# Altium project PumpSystem.PrjPCB (part 4 of 8)
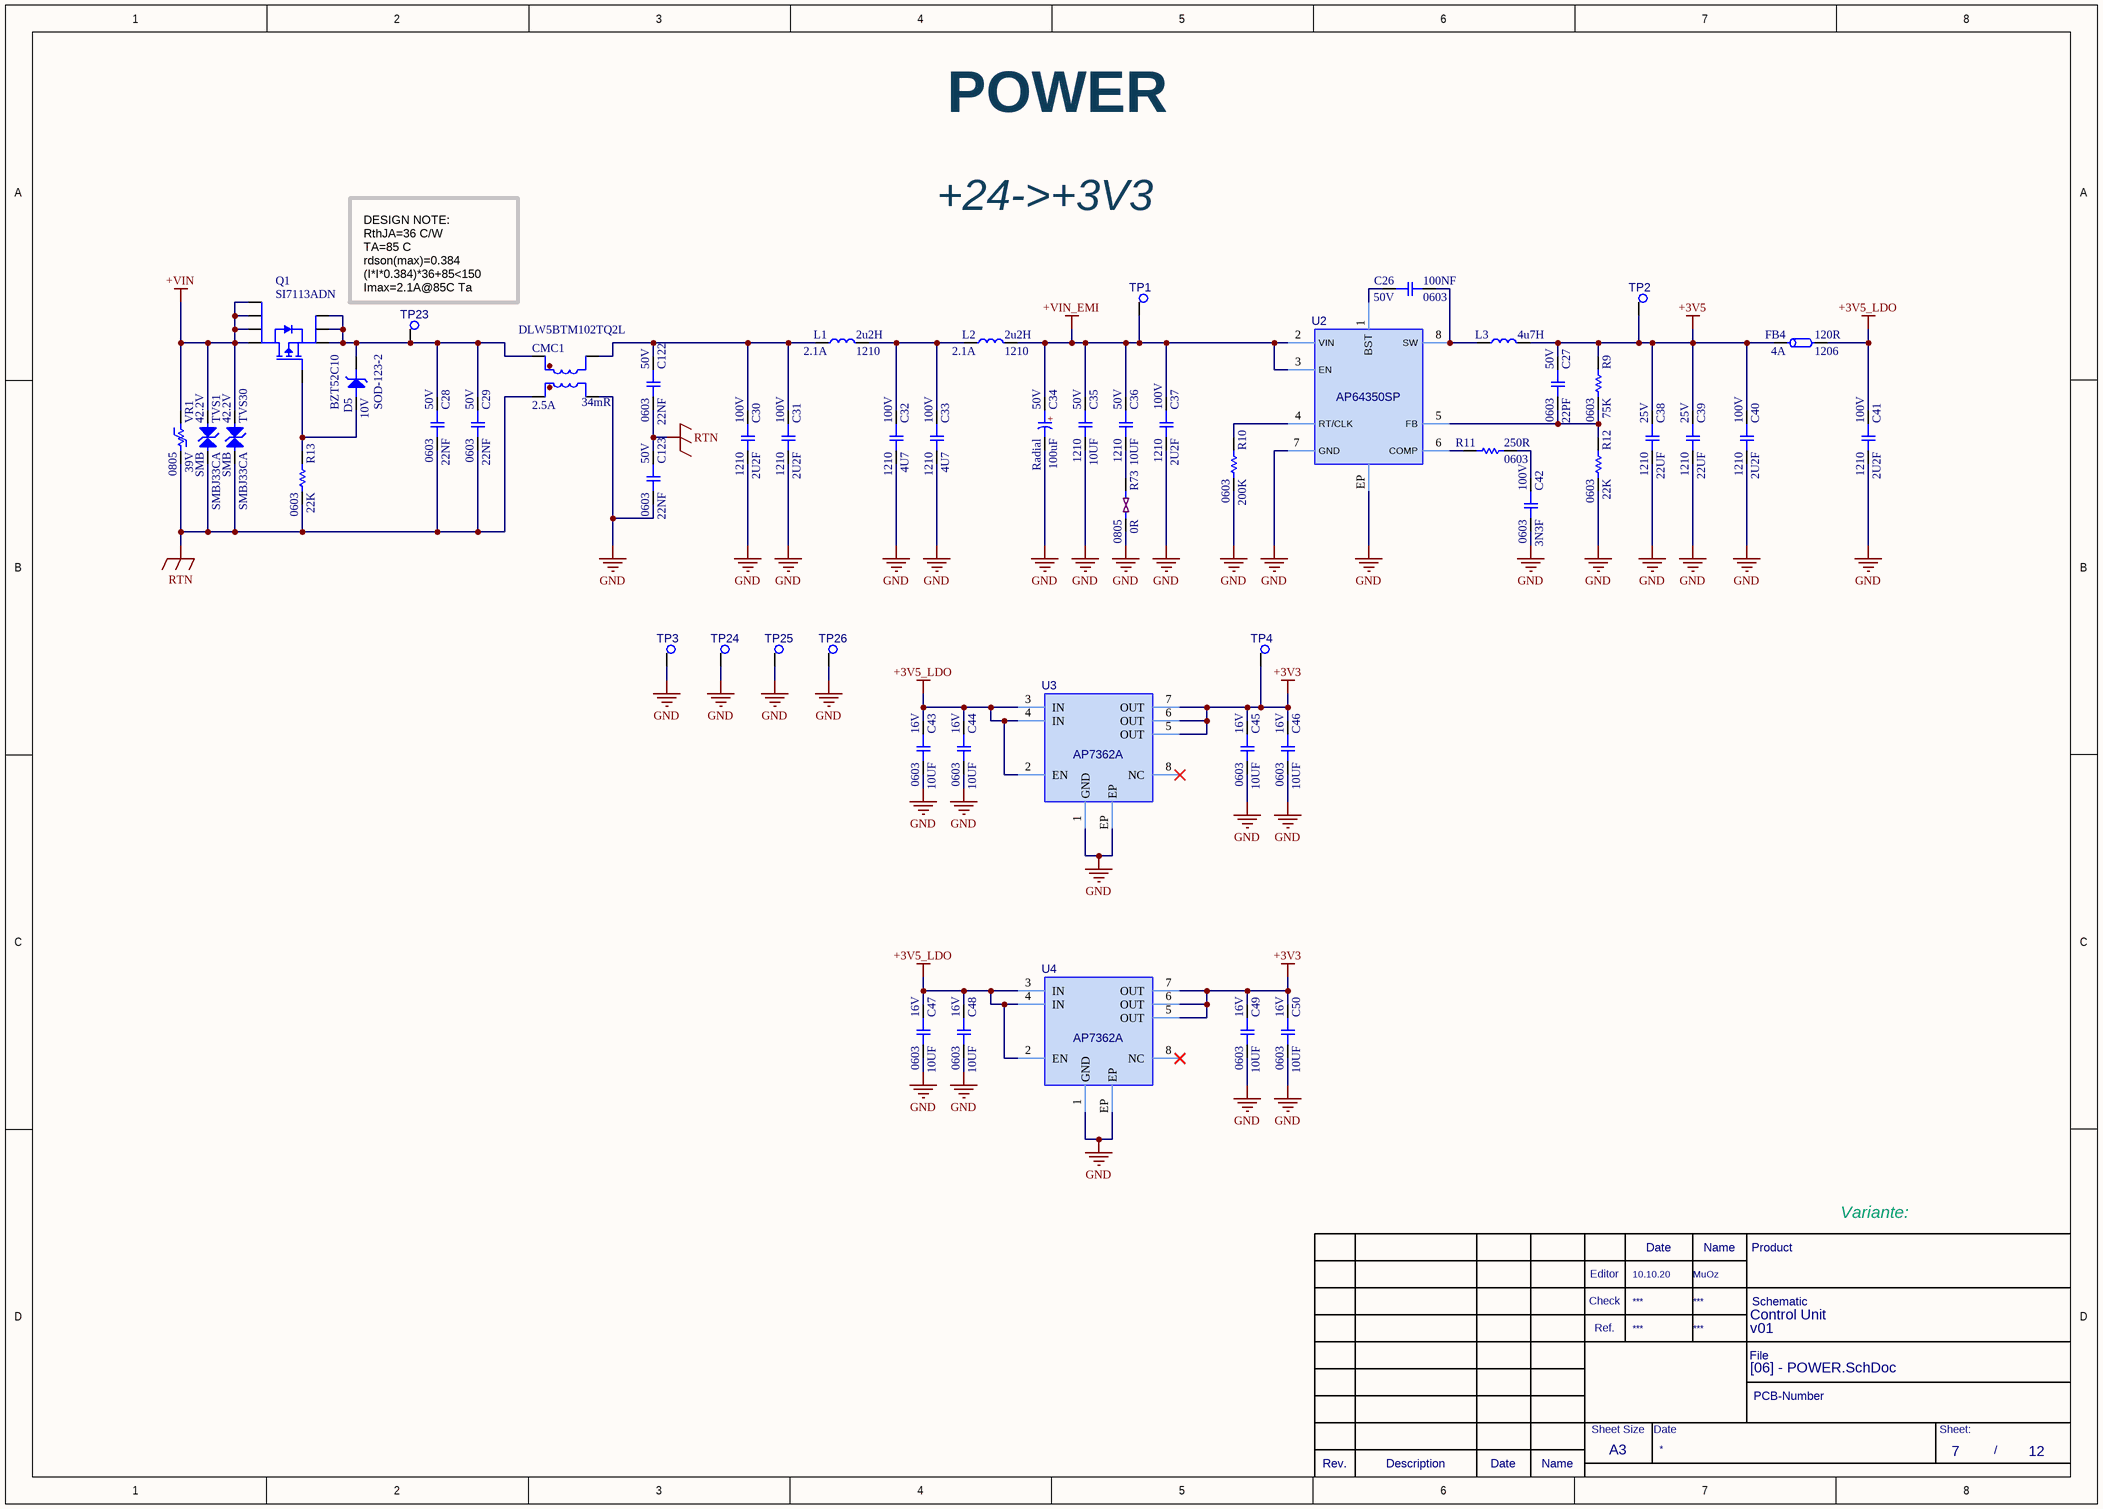
[diagram p12: [06] - POWER.SchDoc]

## Sheet [06] - POWER.SchDoc (continued)

### Library data of the parts
C26 = C-100NF-0603: CAP CER 0.1UF 50V X7R 0603; Manufacturer: TDK; Manufacturer Part Number: C1608X7R1H104K080AA; Dielectric Material: Ceramic; Tolerance: 10%; Temperature Coefficient: 30ppm/°C; .PCBCHK: CHECKED; .Creator: F:TALI; Washability: OK; Supplier 1: Digi-Key; Supplier Part Number 1: 445-1314-1-ND; Stock 1: 0; Pricing 1: 1=0.1, 10=0.057, 100=0.0254, 500=0.01812, 1000=0.01423 (USD); Mount: Surface Mount; Case/Package: 0603; Number of Pins: 2; Weight: 7.1E-05oz; Case Code (Metric): 1608; Min Operating Temperature: -55°C; Max Operating Temperature: 125°C; Capacitance: 100nF; Dielectric: X7R; Packaging: Tape and Reel; Package Quantity: 1; Termination: SMD/SMT; Voltage: 50V; Voltage Rating (DC): 50V; Composition: Ceramic; Length: 1.6mm; Height: 0.8mm; Depth: 0.8mm; Width: 0.8mm; Thickness: 0.037inch; Radiation Hardening: No; REACH SVHC: No SVHC; Lead Free: Lead Free; ComponentLink1URL: http://www.mouser.com/ds/2/400/lcc_commercial_general_en-837201.pdf; ComponentLink1Description: http://www.mouser.com/ds/2/400/lcc_commercial_general_en-837201.pdf; ComponentLink2URL: https://product.tdk.com/info/en/catalog/spec/mlccspec_commercial_general_midvoltage_en.pdf; ComponentLink2Description: https://product.tdk.com/info/en/catalog/spec/mlccspec_commercial_general_midvoltage_en.pdf; ComponentLink3URL: http://uk.rs-online.com/webdocs/13d1/0900766b813d1103.pdf; ComponentLink3Description: http://uk.rs-online.com/webdocs/13d1/0900766b813d1103.pdf; ComponentLink4URL: http://www.tdk.co.jp/tefe02/e412_c.pdf; ComponentLink4Description: http://www.tdk.co.jp/tefe02/e412_c.pdf; ComponentLink5URL: http://www.farnell.com/datasheets/2291921.pdf; ComponentLink5Description: http://www.farnell.com/datasheets/2291921.pdf; ComponentLink6URL: http://www.farnell.com/datasheets/1744655.pdf; ComponentLink6Description: http://www.farnell.com/datasheets/1744655.pdf; Supplier 2: Digi-Key; Supplier Part Number 2: 478-3540-6-ND; Stock 2: 40000; Pricing 2: 1=0.23, 10=0.161, 100=0.0756, 500=0.05304, 1000=0.0439 (USD); Contact Plating: Matte,Tin; Features: Soft Termination; ComponentLink7URL: http://catalogs.avx.com/SurfaceMount.pdf; ComponentLink7Description: http://catalogs.avx.com/SurfaceMount.pdf; ComponentLink8URL: http://www.farnell.com/datasheets/630895.pdf; ComponentLink8Description: http://www.farnell.com/datasheets/630895.pdf; ComponentLink9URL: http://www.avx.com/docs/Catalogs/cx7r.pdf; ComponentLink9Description: http://www.avx.com/docs/Catalogs/cx7r.pdf; ComponentLink10URL: http://www.avx.com/docs/catalogs/cauto.pdf; ComponentLink10Description: http://www.avx.com/docs/catalogs/cauto.pdf; ComponentLink11URL: https://www.verical.com/server-webapp/html/getDatasheet?partID=98691; ComponentLink11Description: https://www.verical.com/server-webapp/html/getDatasheet?partID=98691; ComponentLink12URL: https://www.avx.com/docs/Catalogs/flexiterm.pdf; ComponentLink12Description: https://www.avx.com/docs/Catalogs/flexiterm.pdf; .SCHCHK: CHECKED
C27 = C-22PF-0603: CAP CER 22PF 50V C0G/NP0 0603; Manufacturer: Samsung; Manufacturer Part Number: CL10C220JB8NNNC; Material: Ceramic; Tolerance: 5%; Dielectric: C0G; Temperature Coefficient: 300ppm/°C; Insulation Resistance: 100GR; .PCBCHK: USED; .Creator: F:TALI; Washability: OK; Supplier 1: Digi-Key; Supplier Part Number 1: 1276-1023-6-ND; Stock 1: 0; Pricing 1: 1=0.1, 10=0.056, 100=0.0251, 500=0.0179, 1000=0.01406 (USD); Mount: Surface Mount; Case Code (Metric): 1608; Case Code (Imperial): 0603; Contact Plating: Tin; Min Operating Temperature: -55°C; Max Operating Temperature: 125°C; Capacitance: 22pF; Voltage: 50V; Voltage Rating (DC): 50V; Package Quantity: 1; Packaging: Tape and Reel; Length: 1.6mm; Height: 0.8mm; Depth: 0.8mm; Width: 0.031inch; Thickness: 0.035inch; Radiation Hardening: No; Lead Free: Lead Free; ComponentLink1URL: http://www1.futureelectronics.com/doc/SAMSUNG%20PASSIVE/CL05B104KQ5NNNC.pdf; ComponentLink1Description: http://www1.futureelectronics.com/doc/SAMSUNG%20PASSIVE/CL05B104KQ5NNNC.pdf; ComponentLink2URL: https://media.digikey.com/pdf/Data%20Sheets/Samsung%20PDFs/CL_Series_MLCC_ds.pdf; ComponentLink2Description: https://media.digikey.com/pdf/Data%20Sheets/Samsung%20PDFs/CL_Series_MLCC_ds.pdf; ComponentLink3URL: https://www.distrelec.biz/Web/Downloads/_e/ng/MLCC_CatalogDownload2013_ENG.pdf?mime=application%2Fpdf; ComponentLink3Description: https://www.distrelec.biz/Web/Downloads/_e/ng/MLCC_CatalogDownload2013_ENG.pdf?mime=application%2Fpdf; ComponentLink4URL: https://produktinfo.conrad.com/datenblaetter/450000-474999/457135-da-01-en-VS_KONDENSATOR_0603.pdf; ComponentLink4Description: https://produktinfo.conrad.com/datenblaetter/450000-474999/457135-da-01-en-VS_KONDENSATOR_0603.pdf; Supplier 2: Digi-Key; Supplier Part Number 2: 478-1167-6-ND; Stock 2: 40000; Pricing 2: 1=0.1, 10=0.073, 100=0.0324, 500=0.02314, 1000=0.01818 (USD); Number of Pins: 2; Dielectric Material: Ceramic; Termination: SMD/SMT; REACH SVHC: No SVHC; ComponentLink5URL: http://www.avx.com/docs/Catalogs/ccog.pdf; ComponentLink5Description: http://www.avx.com/docs/Catalogs/ccog.pdf; ComponentLink6URL: https://www.verical.com/server-webapp/html/getDatasheet?partID=60906; ComponentLink6Description: https://www.verical.com/server-webapp/html/getDatasheet?partID=60906; ComponentLink7URL: http://www.farnell.com/datasheets/759117.pdf; ComponentLink7Description: http://www.farnell.com/datasheets/759117.pdf; ComponentLink8URL: http://catalogs.avx.com/SurfaceMount.pdf; ComponentLink8Description: http://catalogs.avx.com/SurfaceMount.pdf; ComponentLink9URL: http://uk.rs-online.com/webdocs/140c/0900766b8140c8fe.pdf; ComponentLink9Description: http://uk.rs-online.com/webdocs/140c/0900766b8140c8fe.pdf; Supplier 3: Digi-Key; Supplier Part Number 3: 1276-2228-6-ND; Stock 3: 3383; Pricing 3: 1=0.1, 10=0.048, 100=0.0214, 500=0.01532, 1000=0.01203 (USD); ComponentLink10URL: http://www1.futureelectronics.com/doc/SAMSUNG/CL10C220JB8NFNC.pdf; ComponentLink10Description: http://www1.futureelectronics.com/doc/SAMSUNG/CL10C220JB8NFNC.pdf; ComponentLink11URL: http://www.samsungsem.com/kr/support/product-search/mlcc/CL10C220JB8NFNC.jsp; ComponentLink11Description: http://www.samsungsem.com/kr/support/product-search/mlcc/CL10C220JB8NFNC.jsp; .SCHCHK: USED
C28 = C-22NF-0603: CAP CER 0.022UF 50V X7R 0603L; Manufacturer: Yageo; Manufacturer Part Number: CC0603KRX7R9BB223; Tolerance: 10%; Dielectric Material: Ceramic; .PCBCHK: USED; .Creator: M.OZKAN; Washability: OK; Insulation Resistance: 100GR; Supplier 1: Digi-Key; Supplier Part Number 1: 311-1370-1-ND; Stock 1: 144094; Pricing 1: 1=0.10000, 10=0.06700, 100=0.03000, 500=0.02140, 1000=0.01682 (USD); Mount: Surface Mount; Min Operating Temperature: -55°C; Max Operating Temperature: 125°C; Capacitance: 22nF; Dielectric: X7R; Packaging: Tape and Reel; Package Quantity: 1; Voltage: 50V; Voltage Rating (DC): 50V; Length: 1.6mm; Height: 0.8mm; Depth: 0.8mm; Width: 0.031inch; Thickness: 0.035inch; Radiation Hardening: No; Lead Free: Lead Free; ComponentLink1URL: https://datasheet.ciiva.com/156/mlccorderingcode-156177.pdf?src-supplier=Digi-Key; ComponentLink1Description: https://datasheet.ciiva.com/156/mlccorderingcode-156177.pdf?src-supplier=Digi-Key; ComponentLink2URL: https://datasheet.ciiva.com/156/mlccorderingcode-156178.pdf?src-supplier=Digi-Key; ComponentLink2Description: https://datasheet.ciiva.com/156/mlccorderingcode-156178.pdf?src-supplier=Digi-Key; Case Code (Metric): 1608; Case Code (Imperial): 0603; ComponentLink3URL: https://datasheet.ciiva.com/156/mlccorderingcode-156179.pdf?src-supplier=Digi-Key; ComponentLink3Description: https://datasheet.ciiva.com/156/mlccorderingcode-156179.pdf?src-supplier=Digi-Key; ComponentLink4URL: https://datasheet.ciiva.com/11464/upy-gphc-x7r-6-3v-to-50v-8-11464741.pdf?src-supplier=Avnet; ComponentLink4Description: https://datasheet.ciiva.com/11464/upy-gphc-x7r-6-3v-to-50v-8-11464741.pdf?src-supplier=Avnet; Number of Pins: 2; Termination: SMD/SMT; REACH SVHC: No SVHC; ComponentLink5URL: https://datasheet.ciiva.com/8033/1489800-8033865.pdf?src-supplier=Element14; ComponentLink5Description: https://datasheet.ciiva.com/8033/1489800-8033865.pdf?src-supplier=Element14; ComponentLink6URL: https://datasheet.ciiva.com/8033/1489800-8033867.pdf?src-supplier=Element14; ComponentLink6Description: https://datasheet.ciiva.com/8033/1489800-8033867.pdf?src-supplier=Element14; ComponentLink7URL: https://datasheet.ciiva.com/16625/upy-gphc-x7r-6-3v-to-50v-8-16625532.pdf?src-supplier=Avnet+Europe; ComponentLink7Description: https://datasheet.ciiva.com/16625/upy-gphc-x7r-6-3v-to-50v-8-16625532.pdf?src-supplier=Avnet+Europe; .SCHCHK: USED; ComponentLink8URL: https://datasheet.ciiva.com/8033/70765-8033869.pdf?src-supplier=Element14; ComponentLink8Description: https://datasheet.ciiva.com/8033/70765-8033869.pdf?src-supplier=Element14; ComponentLink9URL: https://datasheet.ciiva.com/28450/1489800-28450639.pdf?src-supplier=Element14; ComponentLink9Description: https://datasheet.ciiva.com/28450/1489800-28450639.pdf?src-supplier=Element14; RoHS: Yes; Composition: Ceramic; Halogen Free: Halogen Free
C29 C122 C123 = C-22NF-0603: CAP CER 0.022UF 50V X7R 0603L; Manufacturer: Yageo; Manufacturer Part Number: CC0603KRX7R9BB223; Dielectric Material: Ceramic; Insulation Resistance: 100GR; Tolerance: 10%; Washability: OK; .Creator: M.OZKAN; .PCBCHK: USED; Supplier 1: Digi-Key; Supplier Part Number 1: 311-1370-1-ND; Stock 1: 144094; Pricing 1: 1=0.10000, 10=0.06700, 100=0.03000, 500=0.02140, 1000=0.01682 (USD); RoHS: Yes; Mount: Surface Mount; Number of Pins: 2; Case Code (Metric): 1608; Case Code (Imperial): 0603; Min Operating Temperature: -55°C; Max Operating Temperature: 125°C; Termination: SMD/SMT; Composition: Ceramic; Package Quantity: 1; Capacitance: 22nF; Voltage Rating: 50V; Packaging: Tape and Reel; Voltage Rating (DC): 50V; Length: 1.6mm; Height: 0.8mm; Thickness: 0.035inch; Depth: 0.8mm; Width: 0.031inch; Radiation Hardening: No; Lead Free: Lead Free; Halogen Free: Halogen Free; REACH SVHC: No SVHC; ComponentLink1URL: https://datasheet.ciiva.com/156/mlccorderingcode-156177.pdf?src-supplier=Digi-Key; ComponentLink1Description: https://datasheet.ciiva.com/156/mlccorderingcode-156177.pdf?src-supplier=Digi-Key; ComponentLink2URL: https://datasheet.ciiva.com/156/mlccorderingcode-156178.pdf?src-supplier=Digi-Key; ComponentLink2Description: https://datasheet.ciiva.com/156/mlccorderingcode-156178.pdf?src-supplier=Digi-Key; ComponentLink3URL: https://datasheet.ciiva.com/156/mlccorderingcode-156179.pdf?src-supplier=Digi-Key; ComponentLink3Description: https://datasheet.ciiva.com/156/mlccorderingcode-156179.pdf?src-supplier=Digi-Key; ComponentLink4URL: https://datasheet.ciiva.com/11464/upy-gphc-x7r-6-3v-to-50v-8-11464741.pdf?src-supplier=Avnet; ComponentLink4Description: https://datasheet.ciiva.com/11464/upy-gphc-x7r-6-3v-to-50v-8-11464741.pdf?src-supplier=Avnet; ComponentLink5URL: https://datasheet.ciiva.com/8033/1489800-8033865.pdf?src-supplier=Element14; ComponentLink5Description: https://datasheet.ciiva.com/8033/1489800-8033865.pdf?src-supplier=Element14; ComponentLink6URL: https://datasheet.ciiva.com/8033/1489800-8033867.pdf?src-supplier=Element14; ComponentLink6Description: https://datasheet.ciiva.com/8033/1489800-8033867.pdf?src-supplier=Element14; ComponentLink7URL: https://datasheet.ciiva.com/16625/upy-gphc-x7r-6-3v-to-50v-8-16625532.pdf?src-supplier=Avnet+Europe; ComponentLink7Description: https://datasheet.ciiva.com/16625/upy-gphc-x7r-6-3v-to-50v-8-16625532.pdf?src-supplier=Avnet+Europe; ComponentLink8URL: https://datasheet.ciiva.com/8033/70765-8033869.pdf?src-supplier=Element14; ComponentLink8Description: https://datasheet.ciiva.com/8033/70765-8033869.pdf?src-supplier=Element14; ComponentLink9URL: https://datasheet.ciiva.com/28450/1489800-28450639.pdf?src-supplier=Element14; ComponentLink9Description: https://datasheet.ciiva.com/28450/1489800-28450639.pdf?src-supplier=Element14; Dielectric: X7R; .SCHCHK: USED
C30 C31 C37 C40 C41 = C-2U2F-1210: CAP CER 2.2UF 100V X7R 1210; Manufacturer: Samsung; Manufacturer Part Number: CL32B225KCJSNNE; Tolerance: 10%; .PCBCHK: CHECKED; .Creator: F:TALI; Washability: OK; Supplier 1: Digi-Key; Supplier Part Number 1: 1276-3362-6-ND; Stock 1: 0; Pricing 1: 1=0.58, 10=0.41, 100=0.27, 500=0.2 (USD); Mount: Surface Mount; Case Code (Metric): 3225; Case Code (Imperial): 1210; Contact Plating: Tin; Min Operating Temperature: -55°C; Max Operating Temperature: 125°C; Capacitance: 2.2uF; Voltage Rating: 100V; Packaging: Tape and Reel; Package Quantity: 1; Dielectric: X7R; Length: 3.2mm; Height: 2.5mm; Width: 0.098inch; Thickness: 0.106inch; Depth: 2.5mm; Radiation Hardening: No; ComponentLink1URL: http://www1.futureelectronics.com/doc/SAMSUNG/CL32B225KCJSNNE.pdf; ComponentLink1Description: http://www1.futureelectronics.com/doc/SAMSUNG/CL32B225KCJSNNE.pdf; ComponentLink2URL: http://www.samsungsem.com/kr/support/product-search/mlcc/CL32B225KCJSNNE .jsp; ComponentLink2Description: http://www.samsungsem.com/kr/support/product-search/mlcc/CL32B225KCJSNNE .jsp; ComponentLink3URL: https://www.verical.com/server-webapp/html/getDatasheet?partID=357497; ComponentLink3Description: https://www.verical.com/server-webapp/html/getDatasheet?partID=357497; Supplier 2: Digi-Key; Supplier Part Number 2: 445-4497-6-ND; Stock 2: 0; Pricing 2: 1=0.92, 10=0.648, 100=0.4269, 500=0.31626 (USD); Number of Pins: 2; Weight: 0.000564oz; Voltage Rating (DC): 100V; Termination: SMD/SMT; Composition: Ceramic; REACH SVHC: No SVHC; Lead Free: Lead Free; ComponentLink4URL: http://www.mouser.com/ds/2/400/lcc_commercial_general_en-837201.pdf; ComponentLink4Description: http://www.mouser.com/ds/2/400/lcc_commercial_general_en-837201.pdf; ComponentLink5URL: http://www.farnell.com/datasheets/1698875.pdf; ComponentLink5Description: http://www.farnell.com/datasheets/1698875.pdf; ComponentLink6URL: http://www.farnell.com/datasheets/1484596.pdf; ComponentLink6Description: http://www.farnell.com/datasheets/1484596.pdf; ComponentLink7URL: https://www.verical.com/server-webapp/html/getDatasheet?partID=725361; ComponentLink7Description: https://www.verical.com/server-webapp/html/getDatasheet?partID=725361; ComponentLink8URL: http://product.tdk.com/en/catalog/datasheets/mlcc_commercial_midvoltage_en.pdf; ComponentLink8Description: http://product.tdk.com/en/catalog/datasheets/mlcc_commercial_midvoltage_en.pdf; Supplier 3: Digi-Key; Supplier Part Number 3: 587-4235-6-ND; Stock 3: 0; Pricing 3: 1=1.42, 10=1.121, 100=0.8409 (USD); Features: Soft Termination; Ratings: AEC-Q200; .SCHCHK: CHECKED
C32 C33 = C-4U7-1210-100V: CAP CER 4.7UF 100V X7S 1210; Manufacturer: Taiyo Yuden; Manufacturer Part Number: HMK325C7475KM-PE; Tolerance: 10%; Washability: OK; Supplier 1: Digi-Key; Supplier Part Number 1: 587-HMK325C7475KM-PECT-ND; Stock 1: 0; Pricing 1: 1=1.10000, 10=0.83900, 100=0.60030, 500=0.46474 (USD); RoHS: No; Mount: Surface Mount; Min Operating Temperature: -55°C; Max Operating Temperature: 125°C; Packaging: Tape and Reel; Capacitance: 4.7uF; ComponentLink1URL: http://ds.yuden.co.jp/TYCOMPAS/ut/detail.do?productNo=HMK325C7475KM-PE&amp;fileName=HMK325C7475KM-PE_SS&amp;mode=specSheetDownload&src-supplier=Digi-Key; ComponentLink1Description: http://ds.yuden.co.jp/TYCOMPAS/ut/detail.do?productNo=HMK325C7475KM-PE&amp;fileName=HMK325C7475KM-PE_SS&amp;mode=specSheetDownload&src-supplier=Digi-Key
C34 = C-100UF-SMD: CAP ALUM 100UF 20% 50V SMD; Manufacturer: Nichicon; Manufacturer Part Number: UUD1H101MNL1GS; Dielectric Material: Aluminium; Ripple Current: 300mA; Life (Hours): 5000Hour; Impedance: 340mR; Leakage Current: 3uA; Dissipation Factor: 0.14%; Lead Diameter: 1.1mm; .PCBCHK: CHECKED; .Creator: M.OZKAN; Washability: OK; Supplier 1: Digi-Key; Stock 1: 72155; Pricing 1: 1=0.75, 10=0.554, 100=0.3796 (USD); Number of Pins: 2; Min Operating Temperature: -55°C; Max Operating Temperature: 105°C; Tolerance: 20%; Ripple Current (AC): 300mA; Package Quantity: 500; Packaging: Tape and Reel; Voltage Rating: 50V; Termination: SMD/SMT; Voltage: 50V; Diameter: 8mm; Length: 10mm; Height: 10mm; Lead Pitch: 3.1mm; Height - Seated (Max): 0.394inch; Radiation Hardening: No; REACH SVHC: No SVHC; Lead Free: Lead Free; ComponentLink1URL: http://www.farnell.com/datasheets/2100017.pdf; ComponentLink1Description: http://www.farnell.com/datasheets/2100017.pdf; ComponentLink2URL: http://nichicon-us.com/english/products/pdfs/e-uud.pdf; ComponentLink2Description: http://nichicon-us.com/english/products/pdfs/e-uud.pdf; ComponentLink3URL: http://www.nichicon.co.jp/english/products/pdfs/e-ch_ref.pdf; ComponentLink3Description: http://www.nichicon.co.jp/english/products/pdfs/e-ch_ref.pdf; ComponentLink4URL: http://nichicon-us.com/english/products/pdfs/e-ud.pdf; ComponentLink4Description: http://nichicon-us.com/english/products/pdfs/e-ud.pdf; ComponentLink5URL: http://www.farnell.com/datasheets/1910936.pdf; ComponentLink5Description: http://www.farnell.com/datasheets/1910936.pdf; ComponentLink6URL: http://www.farnell.com/datasheets/66055.pdf; ComponentLink6Description: http://www.farnell.com/datasheets/66055.pdf; ComponentLink7URL: http://uk.rs-online.com/webdocs/0fa3/0900766b80fa39e7.pdf; ComponentLink7Description: http://uk.rs-online.com/webdocs/0fa3/0900766b80fa39e7.pdf; ComponentLink8URL: http://www.nichicon.co.jp/english/products/pdfs/e-ud.pdf; ComponentLink8Description: http://www.nichicon.co.jp/english/products/pdfs/e-ud.pdf; Supplier Part Number 1: 493-2306-6-ND; Supplier 2: Digi-Key; Supplier Part Number 2: 565-2495-6-ND; .SCHCHK: CHECKED; Capacitance: 100uF
C35 C36 = C-10UF-1210: CAP CER 10UF 50V X7R 1210; Manufacturer: Samsung; Manufacturer Part Number: CL32B106KBJNNNE; Material: Ceramic; Tolerance: 10%; .PCBCHK: CHECKED; .Creator: M.OZKAN; Washability: OK; Supplier 1: Digi-Key; Supplier Part Number 1: 1276-3387-6-ND; Stock 1: 0; Pricing 1: 1=0.96, 10=0.704, 100=0.483, 500=0.38238 (USD); Mount: Surface Mount; Case Code (Metric): 3225; Case Code (Imperial): 1210; Min Operating Temperature: -55°C; Max Operating Temperature: 125°C; Packaging: Tape and Reel; Package Quantity: 1; Capacitance: 10uF; Dielectric: X7R; Voltage: 50V; Voltage Rating (DC): 50V; Length: 3.2mm; Height: 2.5mm; Width: 0.098inch; Thickness: 0.106inch; Depth: 2.5mm; Radiation Hardening: No; Lead Free: Lead Free; ComponentLink1URL: http://www.samsungsem.com/kr/support/product-search/mlcc/CL32B106KBJNNNE .jsp; ComponentLink1Description: http://www.samsungsem.com/kr/support/product-search/mlcc/CL32B106KBJNNNE .jsp; ComponentLink2URL: https://produktinfo.conrad.com/datenblaetter/450000-474999/450821-da-01-en-VS_KONDENSATOR_1210.pdf; ComponentLink2Description: https://produktinfo.conrad.com/datenblaetter/450000-474999/450821-da-01-en-VS_KONDENSATOR_1210.pdf; Supplier 2: Digi-Key; Supplier Part Number 2: 587-3167-6-ND; Stock 2: 0; Pricing 2: 1=1.02, 10=0.755, 100=0.5175 (USD); Termination: SMD/SMT; Halogen Free: Halogen Free; ComponentLink3URL: https://www.yuden.co.jp/productdata/catalog/mlcc_all_e.pdf; ComponentLink3Description: https://www.yuden.co.jp/productdata/catalog/mlcc_all_e.pdf; Supplier 3: Digi-Key; Supplier Part Number 3: 1276-3388-6-ND; Stock 3: 0; Pricing 3: 1=0.86, 10=0.61, 100=0.4017, 500=0.29756 (USD); ComponentLink4URL: http://www.samsungsem.com/kr/support/product-search/mlcc/CL32B106KBJNNWE.jsp; ComponentLink4Description: http://www.samsungsem.com/kr/support/product-search/mlcc/CL32B106KBJNNWE.jsp; .SCHCHK: CHECKED
C38 C39 = C-22UF-1210: CAP CER 22UF 25V X7R 1210; Manufacturer: Samsung; Manufacturer Part Number: CL32B226KAJNNNE; Material: Ceramic; Tolerance: 10%; .PCBCHK: CHECKED; .Creator: F:TALI; Washability: OK; Supplier 1: Digi-Key; Supplier Part Number 1: 1276-3392-1-ND; Stock 1: 0; Pricing 1: 1=1.02, 10=0.777, 100=0.556, 500=0.43042 (USD); Mount: Surface Mount; Case/Package: 1210; Case Code (Metric): 3225; Min Operating Temperature: -55°C; Max Operating Temperature: 125°C; Package Quantity: 1; Packaging: Tape and Reel; Capacitance: 22uF; Dielectric: X7R; Voltage Rating (DC): 25V; Length: 3.2mm; Height: 2.5mm; Width: 0.098inch; Thickness: 0.106inch; Depth: 2.5mm; Radiation Hardening: No; Lead Free: Lead Free; ComponentLink1URL: https://media.digikey.com/pdf/Data%20Sheets/Samsung%20PDFs/CL_Series_MLCC_ds.pdf; ComponentLink1Description: https://media.digikey.com/pdf/Data%20Sheets/Samsung%20PDFs/CL_Series_MLCC_ds.pdf; Supplier 2: Digi-Key; Supplier Part Number 2: 1276-3391-6-ND; Stock 2: 0; Pricing 2: 1=0.91, 10=0.671, 100=0.4598, 500=0.36402 (USD); ComponentLink2URL: http://www.samsungsem.com/kr/support/product-search/mlcc/CL32B226KAJNFNE.jsp; ComponentLink2Description: http://www.samsungsem.com/kr/support/product-search/mlcc/CL32B226KAJNFNE.jsp; Supplier 3: Digi-Key; Supplier Part Number 3: 399-11958-6-ND; Stock 3: 0; Pricing 3: 1=1.63, 10=1.289, 100=0.9664, 500=0.7302 (USD); Dielectric Material: Ceramic; Voltage: 25V; Dissipation Factor: 10%; Termination: SMD/SMT; .SCHCHK: CHECKED
C42 = C-3N3F-0603: CAP CER 3300PF 100V X7R 0603; Manufacturer Part Number: CGA3E2X7R2A332K080AA; Manufacturer: TDK; Capacitance: 3.3nF; Tolerance: 10%; .PCBCHK: USED; .Creator: F:TALI; Washability: OK; Supplier 1: Digi-Key; Supplier Part Number 1: 445-5809-6-ND; Mount: Surface Mount; Case Code (Imperial): 0603; Case Code (Metric): 1608; Min Operating Temperature: -55°C; Max Operating Temperature: 125°C; Packaging: Tape and Reel; Length: 1.6mm; Width: 0.031inch; Thickness: 0.035inch; ComponentLink1URL: http://www.mouser.com/ds/2/400/lcc_automotive_midvoltage_en-355485.pdf; ComponentLink1Description: http://www.mouser.com/ds/2/400/lcc_automotive_midvoltage_en-355485.pdf; Stock 1: 22990; Pricing 1: 1=0.1, 10=0.076, 100=0.0338, 500=0.02416, 1000=0.01898 (USD); Weight: 7.1E-05oz; Package Quantity: 4000; Voltage Rating (DC): 100V; Dielectric: X7R; Termination: SMD/SMT; Composition: Ceramic; Height: 0.8mm; Depth: 0.8mm; Ratings: AEC-Q200; REACH SVHC: No SVHC; ComponentLink2URL: http://www.farnell.com/datasheets/1807242.pdf; ComponentLink2Description: http://www.farnell.com/datasheets/1807242.pdf; Supplier 2: Digi-Key; Supplier Part Number 2: 490-14767-6-ND; Stock 2: 40000; Pricing 2: 1=0.16, 10=0.114, 100=0.0535, 500=0.03748, 1000=0.03103 (USD); Radiation Hardening: No; Lead Free: Lead Free; ComponentLink3URL: http://search.murata.co.jp/Ceramy/image/img/w_hinm/S0717E.pdf; ComponentLink3Description: http://search.murata.co.jp/Ceramy/image/img/w_hinm/S0717E.pdf; ComponentLink4URL: http://psearch.murata.com/capacitor/product/GCM188R72A332KA37%23.pdf; ComponentLink4Description: http://psearch.murata.com/capacitor/product/GCM188R72A332KA37%23.pdf; .SCHCHK: USED
C43-C50 = C-10UF-0603: CAP CER 10UF 16V X6S 0603; Manufacturer: Murata; Manufacturer Part Number: GRM188C81C106MA73D; Material: Ceramic; Tolerance: 20%; .PCBCHK: USED; .Creator: M.OZKAN; Washability: OK; Supplier 1: Digi-Key; Supplier Part Number 1: 490-7198-6-ND; Stock 1: 0; Pricing 1: 1=0.53, 10=0.366, 100=0.2195, 500=0.16464, 1000=0.13903 (USD); Mount: Surface Mount; Weight: 0.000222oz; Case Code (Metric): 1608; Case Code (Imperial): 0603; Min Operating Temperature: -55°C; Max Operating Temperature: 105°C; Package Quantity: 4000; Packaging: Tape and Reel; Capacitance: 10uF; Dielectric: X6S; Voltage: 16V; Termination: SMD/SMT; Composition: Ceramic; Voltage Rating (DC): 16V; Length: 1.6mm; Height: 0.8mm; Width: 0.8mm; Thickness: 0.031inch; Depth: 0.8mm; REACH SVHC: No SVHC; Lead Free: Lead Free; ComponentLink1URL: https://www.murata.com/~/media/webrenewal/support/library/catalog/products/capacitor/mlcc/c02e.ashx?la=en-us; ComponentLink1Description: https://www.murata.com/~/media/webrenewal/support/library/catalog/products/capacitor/mlcc/c02e.ashx?la=en-us; Supplier 2: Digi-Key; Supplier Part Number 2: 1276-6769-6-ND; Stock 2: 1927; Pricing 2: 1=0.3, 10=0.205, 100=0.1159, 500=0.08184, 1000=0.07161 (USD); .SCHCHK: USED
CMC1 = CMC-DLW5BTM102TQ2L: CMC 2.5A 2LN 1 KOHM SMD; Manufacturer: Murata; Number of Lines: 2; Voltage Rating (DC): 50V; Impedance: 1kR; Supplier 1: Digi-Key; Supplier Part Number 1: 490-14403-1-ND; Manufacturer Part Number: DLW5BTM102TQ2L; Pricing: 1=1.19, 10=1.102, 25=1.0168, 50=0.8474, 100=0.7966, 250=0.7119 (USD); RoHS: No; Mount: Surface Mount; Min Operating Temperature: -40°C; Max Operating Temperature: 105°C; Packaging: Tape and Reel; Length: 5mm; Width: 5mm; Lead Free: Lead Free; ComponentLink1URL: https://www.murata.com/en-us/products/productdata/8796761587742/EFLC0025.pdf?src-supplier=Digi-Key; ComponentLink1Description: https://www.murata.com/en-us/products/productdata/8796761587742/EFLC0025.pdf?src-supplier=Digi-Key; Stock: 6882
D5 = D-BZT52C10-SOD123: DIODE ZENER 10V 500MW SOD123; Manufacturer: Diodes; Manufacturer Part Number: BZT52C10-7-F; Tolerance: 6%; Forward Voltage: 900mV; Impedance: 20R; Zener Current: 5mA; Peak Reverse Current: 200nA; Element Configuration: Single; Output Current: 50mA; ESD Protection: No; .PCBCHK: CHECKED; .Creator: F:TALI; Forward Current: 250mA; Reverse Recovery Time: 4ns; Max Repetitive Reverse Voltage (Vrrm): 100V; Peak Non-Repetitive Surge Current: 4A; Washability: OK; Supplier 1: Digi-Key; Supplier Part Number 1: BZT52C10-FDIDKR-ND; Stock 1: 339; Pricing 1: 1=0.24, 10=0.218, 100=0.1186, 500=0.07296, 1000=0.04975 (USD); Mount: Surface Mount; Number of Pins: 2; Weight: 0.000353oz; Contact Plating: Matte,Tin; Min Operating Temperature: -65°C; Max Operating Temperature: 150°C; Package Quantity: 3000; Packaging: Tape and Reel; Max Power Dissipation: 500mW; Voltage Tolerance: 6%; Test Current: 5mA; Power Dissipation: 500mW; Max Reverse Leakage Current: 200nA; Working Voltage: 10V; Termination: SMD/SMT; Power Rating: 500mW; Voltage Rating (DC): 10V; Length: 2.85mm; Height: 1.35mm; Width: 1.7mm; Radiation Hardening: No; Lead Free: Lead Free; ComponentLink1URL: https://www.diodes.com/assets/Datasheets/ds18004.pdf; ComponentLink1Description: https://www.diodes.com/assets/Datasheets/ds18004.pdf; ComponentLink2URL: http://www.jameco.com/Jameco/Products/ProdDS/1539497.pdf; ComponentLink2Description: http://www.jameco.com/Jameco/Products/ProdDS/1539497.pdf; Supplier 2: Digi-Key; Supplier Part Number 2: MMSZ5240B-FDIDKR-ND; Stock 2: 34933; Pricing 2: 1=0.25, 10=0.204, 100=0.108, 500=0.07108, 1000=0.04833 (USD); ComponentLink3URL: https://www.verical.com/server-webapp/html/getDatasheet?partID=110273; ComponentLink3Description: https://www.verical.com/server-webapp/html/getDatasheet?partID=110273; ComponentLink4URL: http://www.diodes.com/_files/datasheets/ds18010.pdf; ComponentLink4Description: http://www.diodes.com/_files/datasheets/ds18010.pdf; ComponentLink5URL: http://www.jameco.com/Jameco/Products/ProdDS/1541167.pdf; ComponentLink5Description: http://www.jameco.com/Jameco/Products/ProdDS/1541167.pdf; Supplier 3: Digi-Key; Supplier Part Number 3: MMSZ5240B-HE3-08GICT-ND; Stock 3: 14290; Pricing 3: 1=0.3, 10=0.244, 25=0.2044, 100=0.1295, 250=0.09992, 500=0.08516, 1000=0.05791 (USD); ComponentLink6URL: http://www.mouser.com/ds/2/427/mmsz5225-102133.pdf; ComponentLink6Description: http://www.mouser.com/ds/2/427/mmsz5225-102133.pdf; .SCHCHK: CHECKED; Max Surge Current: 4A; Recovery Time: 4ns; Average Rectified Current: 250mA; Max Forward Surge Current (Ifsm): 4A; Max Reverse Voltage (DC): 100V; REACH SVHC: No SVHC; ComponentLink7URL: http://www.nxp.com/documents/data_sheet/BAV70_SER.pdf; ComponentLink7Description: http://www.nxp.com/documents/data_sheet/BAV70_SER.pdf; ComponentLink8URL: http://www.farnell.com/datasheets/1914003.pdf; ComponentLink8Description: http://www.farnell.com/datasheets/1914003.pdf
FB4 = FB-120R-1206: FERRITE BEAD 120 OHM 1206 1LN; Manufacturer: Laird; Manufacturer Part Number: HI1206P121R-10; DC Resistance (DCR): 30mR; Number of Lines: 1; Test Frequency: 100MHz; .PCBCHK: USED; .Creator: F:TALI; Washability: OK; Supplier 1: Digi-Key; Stock 1: 375681; Pricing 1: 1=0.18, 10=0.15, 25=0.1164, 50=0.0966, 100=0.0833, 250=0.0666, 500=0.05994, 1000=0.04995 (USD); Mount: Surface Mount; Case/Package: 1206; Weight: 0.000944oz; Case Code (Metric): 3216; Core Material: Ferrite; Material: Ferrite; Contact Plating: Matte,Tin; Min Operating Temperature: -40°C; Max Operating Temperature: 125°C; Package Quantity: 1; Packaging: Tape and Reel; Max Current Rating: 4A; Impedance: 120R; Max DC Current: 4A; Termination: SMD/SMT; Frequency: 100MHz; Length: 3.2mm; Height: 0.051inch; Width: 1.6mm; Depth: 1.8mm; REACH SVHC: Unknown; Lead Free: Lead Free; ComponentLink1URL: http://assets.lairdtech.com/home/brandworld/files/HI1206P121R-10.pdf; ComponentLink1Description: http://assets.lairdtech.com/home/brandworld/files/HI1206P121R-10.pdf; ComponentLink2URL: http://www.farnell.com/datasheets/1685744.pdf; ComponentLink2Description: http://www.farnell.com/datasheets/1685744.pdf; ComponentLink3URL: http://lairdtech.thomasnet.com/Asset/HI1206P121R-10-A-VP.pdf; ComponentLink3Description: http://lairdtech.thomasnet.com/Asset/HI1206P121R-10-A-VP.pdf; Supplier Part Number 1: 240-2410-6-ND; .SCHCHK: USED
L1 L2 = L-2u2H-74479299222: FIXED IND 2.2UH 2.1A 106 MOHM; Manufacturer: Wurth Electronics; Saturation Current: 3.5A; Shielding: Shielded; DC Resistance (DCR): 106mR; Self Resonant Frequency: 25MHz; Test Frequency: 1MHz; Tolerance: 20%; Supplier 1: Digi-Key; Supplier Part Number 1: 732-9728-1-ND; Manufacturer Part Number: 74479299222; Stock: 4027; Pricing: 1=1.23, 50=1.078, 100=0.935, 1000=0.836 (USD); RoHS: Yes; Mount: Surface Mount; Case Code (Metric): 3225; Case Code (Imperial): 1210; Min Operating Temperature: -40°C; Max Operating Temperature: 125°C; Packaging: Tape and Reel; Inductance: 2.2uH; Inductance Tolerance: 20%; Length: 0.126inch; Width: 0.098inch; Height - Seated (Max): 0.047inch; REACH SVHC: Unknown; ComponentLink1URL: http://www.farnell.com/datasheets/2040044.pdf?src-supplier=Element14; ComponentLink1Description: http://www.farnell.com/datasheets/2040044.pdf?src-supplier=Element14; ComponentLink2URL: https://katalog.we-online.de/pbs/datasheet/74479299222.pdf?src-supplier=Digi-Key; ComponentLink2Description: https://katalog.we-online.de/pbs/datasheet/74479299222.pdf?src-supplier=Digi-Key
L3 = L-4u7H-74438367047: FIXED IND 4.7UH 5.5A 34.5MOHM; Manufacturer: Wurth Electronics; Supplier 1: Digi-Key; Supplier Part Number 1: 732-74438367047CT-ND; Manufacturer Part Number: 74438367047; RoHS: No; Stock: 930; Pricing: 1=1.95, 10=1.77, 50=1.62, 100=1.48 (USD)
Q1 = Q-SI7113ADN-T1-GE3: MOSFET P-CH 100V 10.8A 1212-8; Manufacturer: Vishay; Washability: OK; .Creator: M.OZKAN; .PCBCHK: USED; Input Capacitance: 515pF; Max Power Dissipation: 27.8W; Rds On Max: 132mR; Supplier 1: Digi-Key; Manufacturer Part Number: SI7113ADN-T1-GE3; Stock 1: 12735; Pricing 1: 1=0.65000, 10=0.55800, 100=0.38700, 500=0.30214, 1000=0.24559 (USD); RoHS: No; Supplier Part Number 1: SI7113ADN-T1-GE3CT-ND; .SCHCHK: USED; ComponentLink1URL: https://www.vishay.com/docs/77678/si7113adn.pdf?src-supplier=Digi-Key; ComponentLink1Description: https://www.vishay.com/docs/77678/si7113adn.pdf?src-supplier=Digi-Key; Stock: 19112; Pricing: 1=0.63, 10=0.542, 25=0.5056, 100=0.3757, 500=0.2933, 1000=0.2384 (USD); Mount: Surface Mount; Min Operating Temperature: -55°C; Max Operating Temperature: 150°C; Packaging: Cut Tape; Drain to Source Voltage (Vdss): 100V; Continuous Drain Current (ID): 10.8A; ComponentLink2URL: http://www.farnell.com/datasheets/2687468.pdf?src-supplier=Farnell; ComponentLink2Description: http://www.farnell.com/datasheets/2687468.pdf?src-supplier=Farnell; ComponentLink3URL: http://www.farnell.com/datasheets/2687468.pdf?src-supplier=Element14; ComponentLink3Description: http://www.farnell.com/datasheets/2687468.pdf?src-supplier=Element14; ComponentLink4URL: http://www.farnell.com/datasheets/2687468.pdf?src-supplier=Newark; ComponentLink4Description: http://www.farnell.com/datasheets/2687468.pdf?src-supplier=Newark
R9 = R-75K-0603: RES 100K OHM 1% 1/10W 0603; Manufacturer: Stackpole Electronics; Manufacturer Part Number: RMCF0603FT100K; Resistance: 100kR; Temperature Coefficient: 100ppm/°C; Max Power Dissipation: 100mW; Working Voltage: 75V; Washability: OK; .Creator: M.OZKAN; .PCBCHK: USED; Supplier 1: Digi-Key; Supplier Part Number 1: RMCF0603FT100KCT-ND; Stock 1: 1975649; Pricing 1: 1=0.10000, 10=0.01600, 100=0.00650, 1000=0.00292, 2500=0.00253 (USD); RoHS: Yes; Mount: Surface Mount; Case Code (Metric): 1608; Contact Plating: Tin,Matte; Case Code (Imperial): 0603; Min Operating Temperature: -55°C; Max Operating Temperature: 155°C; Tolerance: 1%; Packaging: Tape and Reel; Composition: Thick Film; Number of Terminations: 2; Features: Automotive AEC-Q200; Military Standard: Not; Power Rating: 100mW; Length: 1.55mm; Height: 0.022inch; Width: 0.031inch; Depth: 0.8mm; Radiation Hardening: No; Lead Free: Lead Free; ComponentLink1URL: https://datasheet.ciiva.com/15193/getdatasheetpartid-362597-15193437.pdf?src-supplier=Verical; ComponentLink1Description: https://datasheet.ciiva.com/15193/getdatasheetpartid-362597-15193437.pdf?src-supplier=Verical; .SCHCHK: USED
R10 = R-200K-0603: RES 200K OHM 1% 1/10W 0603; Manufacturer Part Number: RMCF0603FT200K; Manufacturer: Stackpole Electronics; Resistance: 200kR; Power Rating: 100mW; Temperature Coefficient: 100ppm/°C; Supplier 1: Digi-Key; Supplier Part Number 1: RMCF0603FT200KCT-ND; RoHS: Yes; Stock: 196828; Pricing: 1=0.1, 10=0.015, 100=0.0063, 1000=0.0028, 2500=0.0024 (USD); Mount: Surface Mount; Case Code (Imperial): 0603; Case Code (Metric): 1608; Contact Plating: Tin,Matte; Min Operating Temperature: -55°C; Max Operating Temperature: 155°C; Composition: Thick Film; Number of Terminations: 2; Military Standard: Not; Packaging: Tape and Reel; Features: Automotive AEC-Q200; Tolerance: 1%; Max Power Dissipation: 100mW; Length: 1.55mm; Height: 0.022inch; Depth: 0.8mm; Width: 0.031inch; Radiation Hardening: No; Lead Free: Lead Free; ComponentLink1URL: https://datasheet.ciiva.com/15193/getdatasheetpartid-369944-15193452.pdf?src-supplier=Verical; ComponentLink1Description: https://datasheet.ciiva.com/15193/getdatasheetpartid-369944-15193452.pdf?src-supplier=Verical
R11 = R-250R-0603: RES 250 OHM 0.01% 1/10W 0603; Manufacturer Part Number: RNCF0603TKY250R; Manufacturer: Stackpole Electronics; Max Power Dissipation: 100mW; Temperature Coefficient: 5ppm/°C; Supplier 1: Digi-Key; Supplier Part Number 1: RNCF0603TKY250RCT-ND; RoHS: Yes; Stock: 3231; Pricing: 1=1.86, 10=1.65, 100=1.26 (USD); Mount: Surface Mount; Case Code (Imperial): 0603; Case Code (Metric): 1608; Min Operating Temperature: -55°C; Max Operating Temperature: 155°C; Features: Moisture Resistant; Number of Terminations: 2; Packaging: Tape and Reel; Resistance: 250R; Tolerance: 0.01%; Length: 0.063inch; Height: 0.022inch; Width: 0.031inch; ComponentLink1URL: https://www.seielect.com/catalog/SEI-Packaging.pdf?src-supplier=Digi-Key; ComponentLink1Description: https://www.seielect.com/catalog/SEI-Packaging.pdf?src-supplier=Digi-Key; Resistor Type: Thin Film
R12 = R-22K-0603: RES SMD 22K OHM 1% 1/8W 0603; Manufacturer: Vishay Beyschlag; Manufacturer Part Number: MCT06030C2202FP500; Resistance: 22kR; Temperature Coefficient: 50ppm/°C; Power Rating: 125mW; Voltage Rating: 75V; .PCBCHK: USED; .Creator: F:TALI; Washability: OK; Supplier 1: Digi-Key; Supplier Part Number 1: MCT0603-22.0K-CFDKR-ND; Stock 1: 132469; Pricing 1: 1=0.18, 10=0.152, 100=0.0596, 1000=0.02495, 2500=0.02287 (USD); Case/Package: 0603; Contact Plating: Tin; Case Code (Metric): 1608; Min Operating Temperature: -55°C; Max Operating Temperature: 125°C; Tolerance: 1%; Composition: Thin Film; Package Quantity: 5000; Packaging: Tape and Reel; Number of Terminations: 2; Military Standard: Not; Max Power Dissipation: 125mW; Voltage Rating (DC): 75V; Length: 0.061inch; Height: 0.022inch; Width: 0.033inch; Depth: 0.85mm; Radiation Hardening: No; REACH SVHC: No SVHC; Lead Free: Lead Free; ComponentLink1URL: http://www.vishay.com/docs/28705/mc_pro.pdf; ComponentLink1Description: http://www.vishay.com/docs/28705/mc_pro.pdf; .SCHCHK: USED
R13 = R-22K-0603: RES SMD 22K OHM 1% 1/8W 0603; Manufacturer Part Number: MCT06030C2202FP500; Manufacturer: Vishay Beyschlag; Resistance: 22kR; Max Power Dissipation: 125mW; Temperature Coefficient: 50ppm/°C; .Creator: F:TALI; .PCBCHK: USED; Washability: OK; Voltage Rating: 75V; Supplier 1: Digi-Key; Supplier Part Number 1: MCT0603-22.0K-CFDKR-ND; Case Code (Metric): 1608; Case Code (Imperial): 0603; Contact Plating: Tin; Min Operating Temperature: -55°C; Max Operating Temperature: 125°C; Tolerance: 1%; Composition: Thin Film; Number of Terminations: 2; Packaging: Tape and Reel; Length: 0.061inch; Height: 0.022inch; Width: 0.033inch; Radiation Hardening: No; Stock 1: 132469; Pricing 1: 1=0.18, 10=0.152, 100=0.0596, 1000=0.02495, 2500=0.02287 (USD); Power Rating: 125mW; Lead Free: Lead Free; .SCHCHK: USED; Package Quantity: 5000; Military Standard: Not; Voltage Rating (DC): 75V; Depth: 0.85mm; REACH SVHC: No SVHC; ComponentLink1URL: http://www.vishay.com/docs/28705/mc_pro.pdf; ComponentLink1Description: http://www.vishay.com/docs/28705/mc_pro.pdf
R73 = R-0R-0805: RES SMD 0 OHM JUMPER 1/8W 0805; Manufacturer: Yageo; Manufacturer Part Number: RC0805JR-070RL; Resistance: 0mR; Tolerance: 5%; Power Rating: 125mW; Voltage Rating: 150V; Temperature Coefficient: 200ppm/°C; Max Power Dissipation: 100mW; Current Rating: 1A; Working Voltage: 75V; .PCBCHK: USED; .Creator: F:TALI; Washability: OK; Stock 1: 0; Pricing 1: 1=0.1, 10=0.037, 25=0.0272, 50=0.0206, 100=0.0153, 250=0.01164, 500=0.0093, 1000=0.00685 (USD); Case/Package: 0805; Number of Pins: 2; Contact Plating: Matte,Tin; Case Code (Metric): 2012; Min Operating Temperature: -55°C; Max Operating Temperature: 155°C; Composition: Thick Film; Packaging: Tape and Reel; Voltage Rating (DC): 150V; Termination: SMD/SMT; Military Standard: Not; Length: 2mm; Height: 0.5mm; Width: 1.25mm; Depth: 1.25mm; Radiation Hardening: No; REACH SVHC: Unknown; Lead Free: Lead Free; ComponentLink1URL: http://www.farnell.com/datasheets/1738694.pdf; ComponentLink1Description: http://www.farnell.com/datasheets/1738694.pdf; ComponentLink2URL: http://documents.rs-components.com/techlib://itc_doclist_GB.htm?stockno=6185129; ComponentLink2Description: http://documents.rs-components.com/techlib://itc_doclist_GB.htm?stockno=6185129; ComponentLink3URL: https://www.verical.com/server-webapp/html/getDatasheet?partID=330685; ComponentLink3Description: https://www.verical.com/server-webapp/html/getDatasheet?partID=330685; Stock 2: 10294500; Pricing 2: 100=0.0199, 1000=0.0089, 5000=0.0043, 15000=0.0036, 50000=0.0032 (USD); Package Quantity: 5000; Number of Terminations: 2; Features: Moisture Resistant; ComponentLink4URL: http://www.farnell.com/datasheets/1868787.pdf; ComponentLink4Description: http://www.farnell.com/datasheets/1868787.pdf; ComponentLink5URL: http://www.farnell.com/datasheets/443971.pdf; ComponentLink5Description: http://www.farnell.com/datasheets/443971.pdf; ComponentLink6URL: http://www.yageo.com/documents/recent/PYu-RC_Group_51_RoHS_L_9.pdf; ComponentLink6Description: http://www.yageo.com/documents/recent/PYu-RC_Group_51_RoHS_L_9.pdf; ComponentLink7URL: http://documents.rs-components.com/techlib://itc_doclist_GB.htm?stockno=5048827; ComponentLink7Description: http://documents.rs-components.com/techlib://itc_doclist_GB.htm?stockno=5048827; Stock 3: 3725312; Pricing 3: 1=0.1, 10=0.06, 25=0.0432, 50=0.033, 100=0.0243, 250=0.01852, 500=0.01482, 1000=0.0109 (USD); Mount: Surface Mount; ComponentLink8URL: http://www.farnell.com/datasheets/1678796.pdf; ComponentLink8Description: http://www.farnell.com/datasheets/1678796.pdf; ComponentLink9URL: http://www.farnell.com/datasheets/2371628.pdf; ComponentLink9Description: http://www.farnell.com/datasheets/2371628.pdf; ComponentLink10URL: http://industrial.panasonic.com/www-data/pdf/AOA0000/AOA0000CE1.pdf; ComponentLink10Description: http://industrial.panasonic.com/www-data/pdf/AOA0000/AOA0000CE1.pdf; ComponentLink11URL: http://industrial.panasonic.com/www-cgi/jvcr13pz.cgi?E+PZ+3+AOA0001+ERJ6GEY0R00V+7+WW; ComponentLink11Description: http://industrial.panasonic.com/www-cgi/jvcr13pz.cgi?E+PZ+3+AOA0001+ERJ6GEY0R00V+7+WW; .SCHCHK: USED; Supplier 1: Digi-Key; Supplier Part Number 1: 311-0.0ARDKR-ND
TP1-TP4 TP23-TP26 = MECH-TESTPOINT: .PCBCHK: USED; .Creator: F:TALI; Washability: OK; .SCHCHK: USED
TVS1 TVS30 = TVS-SMBJ33CA-SMB: DIODE TVS 33VWM 53.3VC SMB; Manufacturer: Bourns; Clamping Voltage: 53.3V; Peak Pulse Power: 600W; Reverse Standoff Voltage: 33V; Peak Pulse Current: 11.3A; Polarity: Bidirectional; Test Current: 1mA; Max Surge Current: 100A; Min Breakdown Voltage: 36.7V; Number of Elements: 1; Leakage Current: 5uA; Operating Supply Voltage: 3.5V; Element Configuration: Single; Power Line Protection: No; ESD Protection: Yes; Washability: OK; .Creator: M.OZKAN; .PCBCHK: USED; Supplier 1: Digi-Key; Supplier Part Number 1: SMBJ33CABCT-ND; Manufacturer Part Number: SMBJ33CA; Stock 1: 22606; Pricing 1: 1=0.35000, 10=0.28700, 25=0.26240, 100=0.16490, 250=0.16304, 500=0.15266, 1000=0.10380 (USD); RoHS: Yes; Mount: Surface Mount; Number of Pins: 2; Min Operating Temperature: -55°C; Max Operating Temperature: 150°C; Packaging: Tape and Reel; Package Quantity: 1; Reverse Breakdown Voltage: 36.7V; Number of Channels: 1; Termination: SMD/SMT; Direction: Bidirectional; Max Reverse Leakage Current: 5uA; Max Power Dissipation: 600W; Number of Bidirectional Channels: 1; Max Breakdown Voltage: 42.2V; Composition: Zener; Length: 4.57mm; Height: 2.42mm; Width: 3.94mm; Radiation Hardening: No; REACH SVHC: No SVHC; ComponentLink1URL: https://datasheet.ciiva.com/25624/0900766b81122151-25624666.pdf?src-supplier=RSComponents; ComponentLink1Description: https://datasheet.ciiva.com/25624/0900766b81122151-25624666.pdf?src-supplier=RSComponents; ComponentLink2URL: https://datasheet.ciiva.com/26787/smbj33ca-26787423.pdf?src-supplier=IIIC; ComponentLink2Description: https://datasheet.ciiva.com/26787/smbj33ca-26787423.pdf?src-supplier=IIIC; ComponentLink3URL: https://datasheet.ciiva.com/3022/smbj-3022538.pdf?src-supplier=Avnet; ComponentLink3Description: https://datasheet.ciiva.com/3022/smbj-3022538.pdf?src-supplier=Avnet; ComponentLink4URL: https://datasheet.ciiva.com/8031/1677318-8031157.pdf?src-supplier=Element14; ComponentLink4Description: https://datasheet.ciiva.com/8031/1677318-8031157.pdf?src-supplier=Element14; ComponentLink5URL: https://datasheet.ciiva.com/334/smbj-334697.pdf?src-supplier=Digi-Key; ComponentLink5Description: https://datasheet.ciiva.com/334/smbj-334697.pdf?src-supplier=Digi-Key; ComponentLink6URL: https://datasheet.ciiva.com/334/smbj-334698.pdf?src-supplier=Digi-Key; ComponentLink6Description: https://datasheet.ciiva.com/334/smbj-334698.pdf?src-supplier=Digi-Key; ComponentLink7URL: https://datasheet.ciiva.com/334/smbj-334699.pdf?src-supplier=Digi-Key; ComponentLink7Description: https://datasheet.ciiva.com/334/smbj-334699.pdf?src-supplier=Digi-Key; ComponentLink8URL: https://datasheet.ciiva.com/8031/1677318-8031068.pdf?src-supplier=Element14; ComponentLink8Description: https://datasheet.ciiva.com/8031/1677318-8031068.pdf?src-supplier=Element14; ComponentLink9URL: https://datasheet.ciiva.com/16237/smbj-16237484.pdf?src-supplier=Onlinecomponents.com; ComponentLink9Description: https://datasheet.ciiva.com/16237/smbj-16237484.pdf?src-supplier=Onlinecomponents.com; ComponentLink10URL: https://datasheet.ciiva.com/28410/1677318-28410077.pdf?src-supplier=Element14; ComponentLink10Description: https://datasheet.ciiva.com/28410/1677318-28410077.pdf?src-supplier=Element14; ComponentLink11URL: https://datasheet.ciiva.com/3021/smbj-3021438.pdf?src-supplier=Avnet; ComponentLink11Description: https://datasheet.ciiva.com/3021/smbj-3021438.pdf?src-supplier=Avnet; ComponentLink12URL: https://datasheet.ciiva.com/48712/001056318-da-01-en-tvs-diode-smbj33ca-do-214aa-bou-48712570.pdf?src-supplier=Conrad; ComponentLink12Description: https://datasheet.ciiva.com/48712/001056318-da-01-en-tvs-diode-smbj33ca-do-214aa-bou-48712570.pdf?src-supplier=Conrad; .SCHCHK: USED
U2 = IC-AP64350SP-13: DCDC CONV HV BUCK SO-8EP; Manufacturer 1: Diodes; Supplier 1: Digi-Key; Manufacturer Part Number: AP64350SP-13; RoHS: No; Stock: 3790; Pricing: 1=1,73000, 10=1,55200, 25=1,46440, 100=1,17160, 250=1,02516, 500=0,99586, 1000=0,79083 (USD); Supplier Part Number 1: 31-AP64350SP-13CT-ND
U3 U4 = IC-AP7362A-33SP-13: IC REG LINEAR 3.3V 1.5A 8SO; Manufacturer: Diodes; Number of Regulators: 1; Polarity: Positive; Quiescent Current: 25nA; Min Input Voltage: 2.2V; Max Input Voltage: 5.5V; Accuracy: 1.5%; Output Type: Fixed; Supplier 1: Digi-Key; Supplier Part Number 1: AP7362A-33SP-13DICT-ND; Manufacturer Part Number: AP7362A-33SP-13; Stock: 3699; Pricing: 1=0.6, 10=0.511, 25=0.4772, 100=0.3545, 250=0.3, 500=0.2863, 1000=0.2113 (USD); RoHS: Yes; Mount: Surface Mount; Case/Package: SOP; Number of Pins: 8; Contact Plating: Tin; Min Operating Temperature: -40°C; Max Operating Temperature: 85°C; Packaging: Tape and Reel; Output Voltage: 3.3V; Output Current: 1.5A; Number of Outputs: 1; Max Output Current: 1.5A; ComponentLink1URL: http://www.mouser.com/ds/2/115/AP7362-476331.pdf?src-supplier=Mouser; ComponentLink1Description: http://www.mouser.com/ds/2/115/AP7362-476331.pdf?src-supplier=Mouser; ComponentLink2URL: http://diodes.com/datasheets/AP7362.pdf?src-supplier=Avnet; ComponentLink2Description: http://diodes.com/datasheets/AP7362.pdf?src-supplier=Avnet; ComponentLink3URL: https://www.diodes.com/assets/Datasheets/AP7362.pdf?src-supplier=Digi-Key; ComponentLink3Description: https://www.diodes.com/assets/Datasheets/AP7362.pdf?src-supplier=Digi-Key
VR1 = VR-B72510E1250K62: VARISTOR 39V 80A 0805; Manufacturer: TDK EPCOS; Capacitance: 250pF; Max Voltage Rating (AC): 25V; Max Voltage Rating (DC): 31V; Clamping Voltage: 67V; Clamping Current: 1A; Voltage Tolerance: 10%; Number of Circuits: 1; Energy: 0.3J; Min Varistor Voltage: 35.1V; Max Varistor Voltage: 42.9V; .Creator: F:TALI; .PCBCHK: USED; Washability: OK; Supplier 1: Digi-Key; Manufacturer Part Number: B72510E1250K62; Stock 1: 0; Mount: Surface Mount; Case/Package: 0805; Case Code (Metric): 2012; Min Operating Temperature: -55°C; Max Operating Temperature: 125°C; Max Surge Current: 80A; Packaging: Tape and Reel; Package Quantity: 1; Voltage Rating (DC): 31V; Voltage Rating (AC): 25V; Tolerance: 10%; Termination: SMD/SMT; Length: 2mm; Depth: 1.25mm; ComponentLink1URL: http://www.mouser.com/ds/2/400/Automotive_series-525688.pdf; ComponentLink1Description: http://www.mouser.com/ds/2/400/Automotive_series-525688.pdf; Supplier Part Number 1: 495-4614-1-ND; .SCHCHK: USED